# Altium schematic sheet MCU.SchDoc: Microcontroleur
size Letter; Organization: Robocup Ulaval; DocumentNumber: 10; Revision: 1.0; SheetNumber: 10; SheetTotal: 10; Version: Gamma 1.0; Conceptor: Philippe T. Simon B. Léonard G. Alexia B-L.
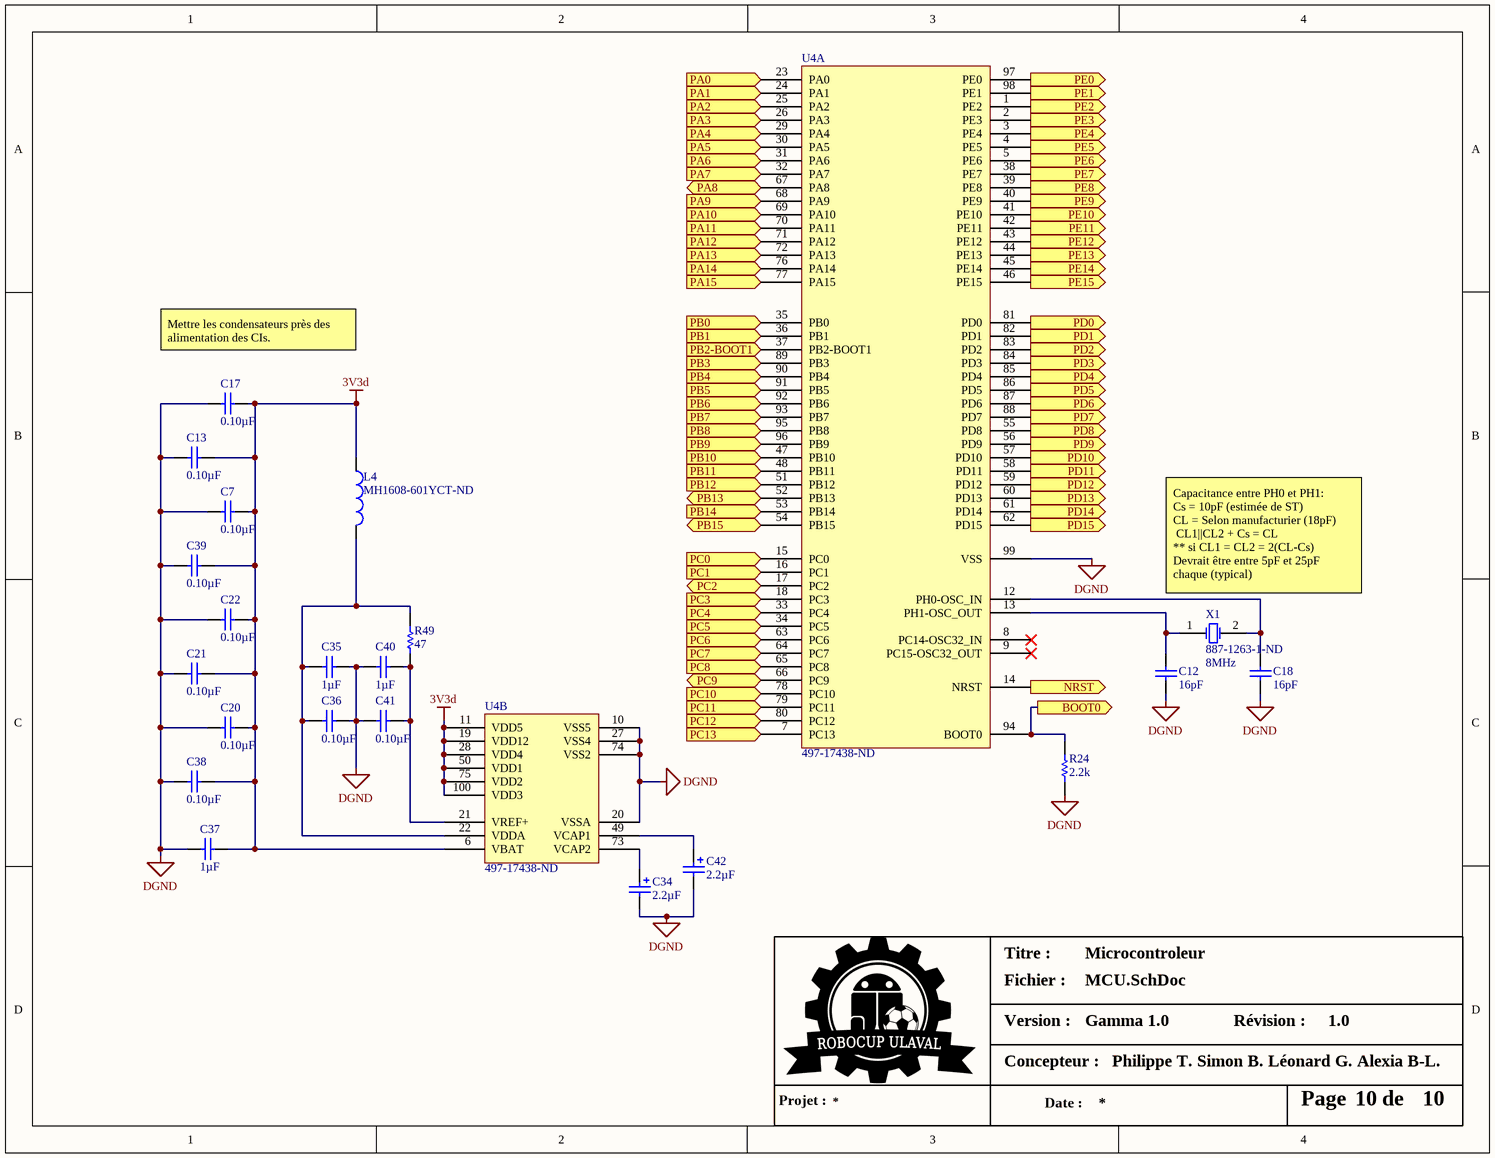
[diagram p0: MCU.SchDoc]

## Parts
C7  Capacitance: 0.10µF  [0603]  (hidden comment: CL10B104KB8SFNC)
C12  Capacitance: 16pF  [0603]  (hidden comment: CL10C160JB8NNNC)
C13  Capacitance: 0.10µF  [0603]  (hidden comment: CL10B104KB8SFNC)
C17  Capacitance: 0.10µF  [0603]  (hidden comment: CL10B104KB8SFNC)
C18  Capacitance: 16pF  [0603]  (hidden comment: CL10C160JB8NNNC)
C20  Capacitance: 0.10µF  [0603]  (hidden comment: CL10B104KB8SFNC)
C21  Capacitance: 0.10µF  [0603]  (hidden comment: CL10B104KB8SFNC)
C22  Capacitance: 0.10µF  [0603]  (hidden comment: CL10B104KB8SFNC)
C34  Capacitance: 2.2µF  [CAP 4.3x4.3mm]  (hidden comment: 865060640002)
C35  Capacitance: 1µF  [0805]  (hidden comment: CL21B105KBFNFNE)
C36  Capacitance: 0.10µF  [0603]  (hidden comment: CL10B104KB8SFNC)
C37  Capacitance: 1µF  [0805]  (hidden comment: CL21B105KBFNFNE)
C38  Capacitance: 0.10µF  [0603]  (hidden comment: CL10B104KB8SFNC)
C39  Capacitance: 0.10µF  [0603]  (hidden comment: CL10B104KB8SFNC)
C40  Capacitance: 1µF  [0805]  (hidden comment: CL21B105KBFNFNE)
C41  Capacitance: 0.10µF  [0603]  (hidden comment: CL10B104KB8SFNC)
C42  Capacitance: 2.2µF  [CAP 4.3x4.3mm]  (hidden comment: 865060640002)
L4  Supplier Part Number 1: MH1608-601YCT-ND  [0603]  (hidden comment: MH1608-601Y)
R24  Resistance (Ohms): 2.2k  [0603]  (hidden comment: RC0603FR-072K2L)
R49  Resistance (Ohms): 47  [0603]  (hidden comment: RC0603JR-0747RL)
U4  Supplier Part Number 1: 497-17438-ND  [TSQFP50P1600X1600X160-100N]  (hidden comment: STM32F407VGT6)  (parts A,B of 2)
X1  Supplier Part Number 1: 887-1263-1-ND  Frequency: 8MHz  [HC49/US]  (hidden comment: 9C-8.000MEEJ-T)

## Ports
BOOT0, NRST (in), PA0 (in), PA1, PA2, PA3, PA4, PA5 (in), PA6 (in), PA7 (in), PA8 (bidir), PA9, PA10, PA11, PA12, PA13, PA14, PA15, PB0 (out), PB1 (out), PB2-BOOT1, PB3, PB4, PB5, PB6 (in), PB7 (in), PB8 (out), PB9 (out), PB10 (out), PB11 (out), PB12 (out), PB13 (bidir), PB14 (in), PB15 (bidir), PC0, PC1, PC2 (bidir), PC3, PC4 (in), PC5 (in), PC6, PC7, PC8, PC9 (bidir), PC10, PC11, PC12, PC13, PD0, PD1, PD2, PD3, PD4, PD5, PD6, PD7, PD8 (in), PD9 (out), PD10 (out), PD11 (out), PD12, PD13, PD14, PD15, PE0, PE1, PE2, PE3, PE4 (in), PE5 (in), PE6 (in), PE7, PE8, PE9 (in), PE10, PE11 (in), PE12, PE13 (out), PE14 (out), PE15 (out)

## Nets
3V3d: C7.2 C13.2 C17.2 C20.2 C21.2 C22.2 C37.2 C38.2 C39.2 L4.1 U4.6(VBAT) U4.11(VDD5) U4.19(VDD12) U4.28(VDD4) U4.50(VDD1) U4.75(VDD2) U4.100(VDD3)
DGND: C7.1 C12.1 C13.1 C17.1 C18.1 C20.1 C21.1 C22.1 C34.2 C35.2 C36.2 C37.1 C38.1 C39.1 C40.1 C41.1 C42.2 R24.1 U4.10(VSS5) U4.20(VSSA) U4.27(VSS4) U4.74(VSS2) U4.99(VSS)
BOOT0: R24.2 U4.94(BOOT0) ; port BOOT0
NRST: U4.14(NRST) ; port NRST
PA0: U4.23(PA0) ; port PA0
PA1: U4.24(PA1) ; port PA1
PA2: U4.25(PA2) ; port PA2
PA3: U4.26(PA3) ; port PA3
PA4: U4.29(PA4) ; port PA4
PA5: U4.30(PA5) ; port PA5
PA6: U4.31(PA6) ; port PA6
PA7: U4.32(PA7) ; port PA7
PA8: U4.67(PA8) ; port PA8
PA9: U4.68(PA9) ; port PA9
PA10: U4.69(PA10) ; port PA10
PA11: U4.70(PA11) ; port PA11
PA12: U4.71(PA12) ; port PA12
PA13: U4.72(PA13) ; port PA13
PA14: U4.76(PA14) ; port PA14
PA15: U4.77(PA15) ; port PA15
PB0: U4.35(PB0) ; port PB0
PB1: U4.36(PB1) ; port PB1
PB2-BOOT1: U4.37(PB2-BOOT1) ; port PB2-BOOT1
PB3: U4.89(PB3) ; port PB3
PB4: U4.90(PB4) ; port PB4
PB5: U4.91(PB5) ; port PB5
PB6: U4.92(PB6) ; port PB6
PB7: U4.93(PB7) ; port PB7
PB8: U4.95(PB8) ; port PB8
PB9: U4.96(PB9) ; port PB9
PB10: U4.47(PB10) ; port PB10
PB11: U4.48(PB11) ; port PB11
PB12: U4.51(PB12) ; port PB12
PB13: U4.52(PB13) ; port PB13
PB14: U4.53(PB14) ; port PB14
PB15: U4.54(PB15) ; port PB15
PC0: U4.15(PC0) ; port PC0
PC1: U4.16(PC1) ; port PC1
PC2: U4.17(PC2) ; port PC2
PC3: U4.18(PC3) ; port PC3
PC4: U4.33(PC4) ; port PC4
PC5: U4.34(PC5) ; port PC5
PC6: U4.63(PC6) ; port PC6
PC7: U4.64(PC7) ; port PC7
PC8: U4.65(PC8) ; port PC8
PC9: U4.66(PC9) ; port PC9
PC10: U4.78(PC10) ; port PC10
PC11: U4.79(PC11) ; port PC11
PC12: U4.80(PC12) ; port PC12
PC13: U4.7(PC13) ; port PC13
PD0: U4.81(PD0) ; port PD0
PD1: U4.82(PD1) ; port PD1
PD2: U4.83(PD2) ; port PD2
PD3: U4.84(PD3) ; port PD3
PD4: U4.85(PD4) ; port PD4
PD5: U4.86(PD5) ; port PD5
PD6: U4.87(PD6) ; port PD6
PD7: U4.88(PD7) ; port PD7
PD8: U4.55(PD8) ; port PD8
PD9: U4.56(PD9) ; port PD9
PD10: U4.57(PD10) ; port PD10
PD11: U4.58(PD11) ; port PD11
PD12: U4.59(PD12) ; port PD12
PD13: U4.60(PD13) ; port PD13
PD14: U4.61(PD14) ; port PD14
PD15: U4.62(PD15) ; port PD15
PE0: U4.97(PE0) ; port PE0
PE1: U4.98(PE1) ; port PE1
PE2: U4.1(PE2) ; port PE2
PE3: U4.2(PE3) ; port PE3
PE4: U4.3(PE4) ; port PE4
PE5: U4.4(PE5) ; port PE5
PE6: U4.5(PE6) ; port PE6
PE7: U4.38(PE7) ; port PE7
PE8: U4.39(PE8) ; port PE8
PE9: U4.40(PE9) ; port PE9
PE10: U4.41(PE10) ; port PE10
PE11: U4.42(PE11) ; port PE11
PE12: U4.43(PE12) ; port PE12
PE13: U4.44(PE13) ; port PE13
PE14: U4.45(PE14) ; port PE14
PE15: U4.46(PE15) ; port PE15
NetC12_2: C12.2 U4.13(PH1-OSC_OUT) X1.1(OSC1)
NetC18_2: C18.2 U4.12(PH0-OSC_IN) X1.2(OSC2)
NetC34_1: C34.1 U4.73(VCAP2)
NetC35_1: C35.1 C36.1 L4.2 R49.2 U4.22(VDDA)
NetC40_2: C40.2 C41.2 R49.1 U4.21(VREF+)
NetC42_1: C42.1 U4.49(VCAP1)

Not connected (* = marked no-connect by the designer): U4 8(PC14-OSC32_IN)* 9(PC15-OSC32_OUT)*

## Notes on the sheet
- Mettre les condensateurs près des alimentation des CIs.
- (near X1) Capacitance entre PH0 et PH1:
  Cs = 10pF (estimée de ST)
  CL = Selon manufacturier (18pF)
  CL1||CL2 + Cs = CL
  ** si CL1 = CL2 = 2(CL-Cs)
  Devrait être entre 5pF et 25pF chaque (typical)
- Titre :
- Version :
- Fichier :
- Révision :
- Projet :
- Concepteur :
- Date :
- Page
- de

## Library data of the parts
C7 C13 C17 C20-C22 C36 C38 C39 C41 = CL10B104KB8SFNC: CAP CER 0.1UF 50V X7R 0603; Manufacturer: Samsung Electro-Mechanics America, Inc.; Tolerance: ±10%; Supplier 1: Digi-Key; Manufacturer Part Number: CL10B104KB8SFNC; RoHS: RoHS Compliant; Category: Capacitors; Packaging: Cut Tape (CT); Voltage - Rated: 50V; Temperature Coefficient: X7R; Mounting Type: Surface Mount, MLCC; Operating Temperature: -55°C ~ 125°C; Applications: Boardflex Sensitive; Ratings: -; Package / Case: 0603 (1608 Metric); Size / Dimension: 0.063" L x 0.031" W (1.60mm x 0.80mm); Height - Seated (Max): -; Thickness (Max): 0.035" (0.90mm); Lead Spacing: -; Features: Soft Termination; Lead Style: -; ComponentLink1URL: http://www.samsungsem.com/kr/support/product-search/mlcc/CL10B104KB8SFNC.jsp; ComponentLink1Description: http://www.samsungsem.com/kr/support/product-search/mlcc/CL10B104KB8SFNC.jsp; Supplier Part Number 1: 445-173846-1-ND
C12 C18 = CL10C160JB8NNNC: CAP CER 16PF 50V NP0 0603; Manufacturer: Samsung Electro-Mechanics America, Inc.; Tolerance: ±5%; Temperature Coefficient: C0G, NP0; Supplier 1: Digi-Key; Manufacturer Part Number: CL10C160JB8NNNC; RoHS: RoHS Compliant; Category: Capacitors; Stock 1: 38262; Pricing 1: 1=0.14, 10=0.053, 25=0.0376, 50=0.0284, 100=0.0242, 500=0.01692, 1000=0.01318 (CAD); Packaging: Cut Tape (CT); Voltage - Rated: 50V; Mounting Type: Surface Mount, MLCC; Operating Temperature: -55°C ~ 125°C; Applications: General Purpose; Ratings: -; Package / Case: 0603 (1608 Metric); Size / Dimension: 0.063" L x 0.031" W (1.60mm x 0.80mm); Height - Seated (Max): -; Thickness (Max): 0.035" (0.90mm); Lead Spacing: -; Features: -; Lead Style: -; ComponentLink1URL: http://www.samsungsem.com/kr/support/product-search/mlcc/CL10C160JB8NNNC.jsp; ComponentLink1Description: http://www.samsungsem.com/kr/support/product-search/mlcc/CL10C160JB8NNNC.jsp; Supplier Part Number 1: 1276-2204-1-ND
C34 C42 = 865060640002: CAP 2.2 UF 20% 50 V; Manufacturer: Wurth Electronics Inc; Voltage Rating: 50V; Lifetime @ Temp.: 2000 Hrs @ 105°C; Polarization: Polar; Ripple Current: 60mA @ 100kHz; Impedance: 2.9 Ohm; Surface Mount Land Size: 0.169" L x 0.169" W (4.30mm x 4.30mm); Supplier 1: Digi-Key; Manufacturer Part Number: 865060640002; RoHS: RoHS Compliant; Category: Capacitors; Stock 1: 1681; Pricing 1: 1=0.26, 50=0.217, 100=0.1888, 250=0.16788, 500=0.1469, 1000=0.1399 (CAD); Packaging: Cut Tape (CT); Tolerance: ±20%; ESR (Equivalent Series Resistance): -; Operating Temperature: -55°C ~ 105°C; Applications: General Purpose; Lead Spacing: -; Size / Dimension: 0.157" Dia (4.00mm); Height - Seated (Max): 0.217" (5.50mm); Mounting Type: Surface Mount; Package / Case: Radial, Can - SMD; ComponentLink1URL: http://katalog.we-online.de/pbs/datasheet/865060640002.pdf; ComponentLink1Description: http://katalog.we-online.de/pbs/datasheet/865060640002.pdf; Supplier Part Number 1: 732-8542-1-ND
C35 C37 C40 = CL21B105KBFNFNE: CAP CER 1UF 50V X7R 0805; Manufacturer: Samsung Electro-Mechanics America, Inc.; Tolerance: ±10%; Supplier 1: Digi-Key; Manufacturer Part Number: CL21B105KBFNFNE; RoHS: RoHS Compliant; Stock 1: 21699; Pricing 1: 1=0.27, 10=0.186, 25=0.14, 50=0.1072, 100=0.0884, 500=0.06238, 1000=0.05123 (CAD); Packaging: Cut Tape (CT); Voltage - Rated: 50V; Temperature Coefficient: X7R; Mounting Type: Surface Mount, MLCC; Operating Temperature: -55°C ~ 125°C; Applications: General Purpose; Ratings: -; Package / Case: 0805 (2012 Metric); Size / Dimension: 0.079" L x 0.049" W (2.00mm x 1.25mm); Height - Seated (Max): -; Thickness (Max): 0.053" (1.35mm); Lead Spacing: -; Features: -; Lead Style: -; ComponentLink1URL: http://www.samsungsem.com/kr/support/product-search/mlcc/CL21B105KBFNFNE.jsp; ComponentLink1Description: http://www.samsungsem.com/kr/support/product-search/mlcc/CL21B105KBFNFNE.jsp; Supplier Part Number 1: 1276-2928-1-ND; Category: Capacitors
L4 = MH1608-601Y: FERRITE BEAD 600 OHM 0603 1LN; Manufacturer: Bourns Inc.; Filter Type: Power, Signal Line; Number of Lines: 1; Impedance @ Frequency: 600 Ohm @ 100MHz; Current Rating (Max): 1A; DC Resistance (DCR) (Max): 200 mOhm; Supplier 1: Digi-Key; Manufacturer Part Number: MH1608-601Y; RoHS: RoHS Compliant; Category: Filters; Stock 1: 112010; Pricing 1: 1=0.14, 10=0.088, 25=0.0808, 50=0.0726, 100=0.0533, 250=0.03872, 500=0.03552, 1000=0.03067 (CAD); Packaging: Cut Tape (CT); Ratings: -; Operating Temperature: -55°C ~ 125°C; Package / Case: 0603 (1608 Metric); Mounting Type: Surface Mount; Height (Max): 0.039" (1.00mm); Size / Dimension: 0.063" L x 0.031" W (1.60mm x 0.80mm); ComponentLink1URL: http://www.bourns.com/docs/Product-Datasheets/mh.pdf; ComponentLink1Description: http://www.bourns.com/docs/Product-Datasheets/mh.pdf
R24 = RC0603FR-072K2L: RES SMD 2.2K OHM 1% 1/10W 0603; Manufacturer: Yageo; Power (Watts): 0.1W, 1/10W; Temperature Coefficient: ±100ppm/°C; Supplier 1: Digi-Key; Manufacturer Part Number: RC0603FR-072K2L; RoHS: RoHS Compliant; Category: Resistors; Stock 1: 297758; Pricing 1: 1=0.15, 10=0.021, 25=0.0152, 100=0.0086, 250=0.0066, 500=0.00526, 1000=0.00389, 2500=0.00337 (CAD); Packaging: Cut Tape (CT); Tolerance: ±1%; Composition: Thick Film; Features: Moisture Resistant; Operating Temperature: -55°C ~ 155°C; Package / Case: 0603 (1608 Metric); Supplier Device Package: 0603; Size / Dimension: 0.063" L x 0.031" W (1.60mm x 0.80mm); Height: 0.022" (0.55mm); Number of Terminations: 2; ComponentLink1URL: http://www.yageo.com/documents/recent/PYu-RC_Group_51_RoHS_L_04.pdf; ComponentLink1Description: http://www.yageo.com/documents/recent/PYu-RC_Group_51_RoHS_L_04.pdf; Supplier Part Number 1: 311-2.20KHRCT-ND
R49 = RC0603JR-0747RL: RES SMD 47 OHM 5% 1/10W 0603; Manufacturer: Yageo; Power (Watts): 0.1W, 1/10W; Temperature Coefficient: ±100ppm/°C; Supplier 1: Digi-Key; Manufacturer Part Number: RC0603JR-0747RL; RoHS: RoHS Compliant; Category: Resistors; Stock 1: 231668; Pricing 1: 1=0.15, 10=0.017, 25=0.012, 100=0.0067, 250=0.00508, 500=0.00408, 1000=0.003, 2500=0.0026 (CAD); Packaging: Cut Tape (CT); Tolerance: ±5%; Composition: Thick Film; Features: Moisture Resistant; Operating Temperature: -55°C ~ 155°C; Package / Case: 0603 (1608 Metric); Supplier Device Package: 0603; Size / Dimension: 0.063" L x 0.031" W (1.60mm x 0.80mm); Height: 0.022" (0.55mm); Number of Terminations: 2; ComponentLink1URL: http://www.yageo.com/documents/recent/PYu-RC_Group_51_RoHS_L_04.pdf; ComponentLink1Description: http://www.yageo.com/documents/recent/PYu-RC_Group_51_RoHS_L_04.pdf; Supplier Part Number 1: 311-47GRCT-ND
U4 = STM32F407VGT6: IC MCU 32BIT 1MB FLASH 100LQFP; Manufacturer: STMicroelectronics; Core Processor: ARM® Cortex®-M4; Core Size: 32-Bit; Speed: 168MHz; Connectivity: CAN, DCMI, EBI/EMI, Ethernet, I²C, IrDA, LIN, SPI, UART/USART, USB OTG; Peripherals: Brown-out Detect/Reset, DMA, I²S, LCD, POR, PWM, WDT; Number of I/O: 82; Program Memory Size: 1MB (1M x 8); RAM Size: 192K x 8; Voltage - Supply (Vcc/Vdd): 1.8 V ~ 3.6 V; Data Converters: A/D 16x12b, D/A 2x12b; Oscillator Type: Internal; Supplier 1: Digi-Key; Manufacturer Part Number: STM32F407VGT6; RoHS: RoHS Compliant; Category: Integrated Circuits (ICs); Packaging: Tray; Program Memory Type: FLASH; EEPROM Size: -; Operating Temperature: -40°C ~ 85°C (TA); Package / Case: 100-LQFP; Supplier Device Package: 100-LQFP (14x14); ComponentLink1URL: http://www.st.com/web/en/resource/technical/document/datasheet/DM00037051.pdf; ComponentLink1Description: http://www.st.com/web/en/resource/technical/document/datasheet/DM00037051.pdf
X1 = 9C-8.000MEEJ-T: CRYSTAL 8.0000MHZ 18PF SMD; Manufacturer: TXC CORPORATION; Frequency Stability: ±10ppm; ESR (Equivalent Series Resistance): 80 Ohm; Operating Mode: Fundamental; Supplier 1: Digi-Key; Manufacturer Part Number: 9C-8.000MEEJ-T; RoHS: RoHS Compliant; Category: Crystals and Oscillators; Stock 1: 25785; Pricing 1: 1=0.89, 10=0.749, 50=0.6746, 100=0.5996, 500=0.56958 (CAD); Packaging: Cut Tape (CT); Type: MHz Crystal; Frequency Tolerance: ±10ppm; Load Capacitance: 18pF; Operating Temperature: -20°C ~ 70°C; Ratings: -; Mounting Type: Surface Mount; Package / Case: HC49/US; Size / Dimension: 0.449" L x 0.189" W (11.40mm x 4.80mm); Height: 0.161" (4.10mm); ComponentLink1URL: http://www.txccrystal.com/images/pdf/9c-accuracy.pdf; ComponentLink1Description: http://www.txccrystal.com/images/pdf/9c-accuracy.pdf